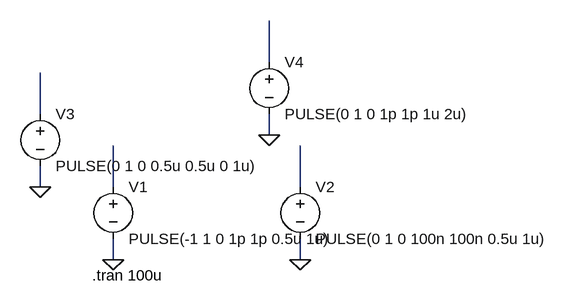
[diagram p0: schematic fft.asc]
fft.asc, the LTspice schematic file:
Version 4
SHEET 1 880 680
WIRE 336 -64 336 -128
WIRE -16 16 -16 -48
WIRE 336 48 336 16
WIRE -16 128 -16 96
WIRE 96 128 96 64
WIRE 384 128 384 64
WIRE 96 240 96 208
WIRE 384 240 384 208
FLAG 96 240 0
FLAG 384 240 0
FLAG -16 128 0
FLAG 336 48 0
SYMBOL voltage 96 112 R0
WINDOW 123 0 0 Left 2
WINDOW 39 0 0 Left 2
SYMATTR InstName V1
SYMATTR Value PULSE(-1 1 0 1p 1p 0.5u 1u)
SYMBOL voltage 384 112 R0
WINDOW 123 0 0 Left 2
WINDOW 39 0 0 Left 2
SYMATTR InstName V2
SYMATTR Value PULSE(0 1 0 100n 100n 0.5u 1u)
SYMBOL voltage -16 0 R0
WINDOW 123 0 0 Left 2
WINDOW 39 0 0 Left 2
SYMATTR InstName V3
SYMATTR Value PULSE(0 1 0 0.5u 0.5u 0 1u)
SYMBOL voltage 336 -80 R0
WINDOW 123 0 0 Left 2
WINDOW 39 0 0 Left 2
SYMATTR InstName V4
SYMATTR Value PULSE(0 1 0 1p 1p 1u 2u)
TEXT 64 264 Left 2 !.tran 100u

The netlist it stands for:
* fft.asc
V1 N003 0 PULSE(-1 1 0 1p 1p 0.5u 1u)
V2 N004 0 PULSE(0 1 0 100n 100n 0.5u 1u)
V3 N002 0 PULSE(0 1 0 0.5u 0.5u 0 1u)
V4 N001 0 PULSE(0 1 0 1p 1p 1u 2u)
.tran 100u
.backanno
.end